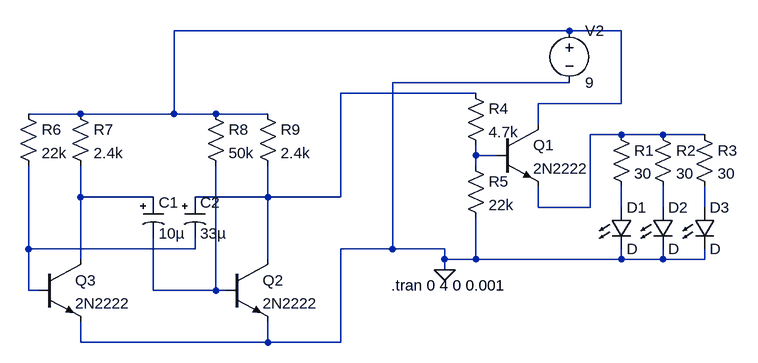
[diagram p0: schematic main_light.asc]
main_light.asc, the LTspice schematic file:
Version 4
SHEET 1 880 680
WIRE 176 -48 -432 -48
WIRE 256 -48 176 -48
WIRE 176 32 -96 32
WIRE 32 48 -176 48
WIRE 256 64 256 -48
WIRE 256 64 128 64
WIRE -576 80 -656 80
WIRE -432 80 -432 -48
WIRE -432 80 -576 80
WIRE -368 80 -432 80
WIRE -288 80 -368 80
WIRE 128 96 128 64
WIRE 256 112 208 112
WIRE 320 112 256 112
WIRE 384 112 320 112
WIRE 32 144 32 128
WIRE 64 144 32 144
WIRE 32 160 32 144
WIRE -576 208 -576 160
WIRE -464 208 -576 208
WIRE -288 208 -288 160
WIRE -288 208 -400 208
WIRE -176 208 -176 48
WIRE -176 208 -288 208
WIRE 128 224 128 192
WIRE 208 224 208 112
WIRE 208 224 128 224
WIRE 256 224 256 192
WIRE 320 224 320 192
WIRE 384 224 384 192
WIRE -656 288 -656 160
WIRE -400 288 -400 272
WIRE -400 288 -656 288
WIRE -96 288 -96 32
WIRE -96 288 -176 288
WIRE -16 288 -96 288
WIRE -576 304 -576 208
WIRE -288 304 -288 208
WIRE -16 304 -16 288
WIRE 32 304 32 240
WIRE 32 304 -16 304
WIRE 256 304 256 288
WIRE 256 304 32 304
WIRE 320 304 320 288
WIRE 320 304 256 304
WIRE 384 304 384 288
WIRE 384 304 320 304
WIRE -16 320 -16 304
WIRE -656 352 -656 288
WIRE -640 352 -656 352
WIRE -464 352 -464 272
WIRE -368 352 -368 160
WIRE -368 352 -464 352
WIRE -352 352 -368 352
WIRE -576 432 -576 400
WIRE -288 432 -288 400
WIRE -288 432 -576 432
WIRE -176 432 -176 288
WIRE -176 432 -288 432
FLAG -16 320 0
SYMBOL npn 64 96 R0
SYMATTR InstName Q1
SYMATTR Value 2N2222
SYMBOL res 240 96 R0
SYMATTR InstName R1
SYMATTR Value 30
SYMBOL res 304 96 R0
SYMATTR InstName R2
SYMATTR Value 30
SYMBOL res 368 96 R0
SYMATTR InstName R3
SYMATTR Value 30
SYMBOL LED 240 224 R0
SYMATTR InstName D1
SYMBOL LED 304 224 R0
SYMATTR InstName D2
SYMBOL LED 368 224 R0
SYMATTR InstName D3
SYMBOL voltage 176 -64 R0
WINDOW 123 0 0 Left 2
WINDOW 39 0 0 Left 2
SYMATTR InstName V2
SYMATTR Value 9
SYMBOL res 16 32 R0
SYMATTR InstName R4
SYMATTR Value 4.7k
SYMBOL res 16 144 R0
SYMATTR InstName R5
SYMATTR Value 22k
SYMBOL res -672 64 R0
SYMATTR InstName R6
SYMATTR Value 22k
SYMBOL res -592 64 R0
SYMATTR InstName R7
SYMATTR Value 2.4k
SYMBOL res -384 64 R0
SYMATTR InstName R8
SYMATTR Value 50k
SYMBOL res -304 64 R0
SYMATTR InstName R9
SYMATTR Value 2.4k
SYMBOL polcap -480 208 R0
WINDOW 3 24 56 Left 2
SYMATTR InstName C1
SYMATTR Value 10µ
SYMATTR Description Capacitor
SYMATTR Type cap
SYMATTR SpiceLine V=63 Irms=145m Rser=0.93 Lser=0
SYMBOL polcap -416 208 R0
WINDOW 3 24 56 Left 2
SYMATTR InstName C2
SYMATTR Value 33µ
SYMATTR Description Capacitor
SYMATTR Type cap
SYMATTR SpiceLine V=10 Irms=2.1 Rser=0.028 Lser=0 mfg="KEMET" pn="A700V336M010ATE028" type="Al electrolytic"
SYMBOL npn -352 304 R0
SYMATTR InstName Q2
SYMATTR Value 2N2222
SYMBOL npn -640 304 R0
SYMATTR InstName Q3
SYMATTR Value 2N2222
TEXT -98 344 Left 2 !.tran 0 4 0 0.001

The netlist it stands for:
* main_light.asc
Q1 N001 N004 N003 0 2N2222
R1 N003 N006 30
R2 N003 N007 30
R3 N003 N008 30
D1 N006 0 D
D2 N007 0 D
D3 N008 0 D
V2 N001 0 9
R4 N002 N004 4.7k
R5 N004 0 22k
R6 N001 N009 22k
R7 N001 N005 2.4k
R8 N001 N010 50k
R9 N001 N002 2.4k
C1 N005 N010 10µ V=63 Irms=145m Rser=0.93 Lser=0
C2 N002 N009 33µ V=10 Irms=2.1 Rser=0.028 Lser=0 mfg="KEMET" pn="A700V336M010ATE028" type="Al electrolytic"
Q2 N002 N010 0 0 2N2222
Q3 N005 N009 0 0 2N2222
.model D D
.lib standard.dio
.model NPN NPN
.model PNP PNP
.lib standard.bjt
.tran 0 4 0 0.001
.backanno
.end